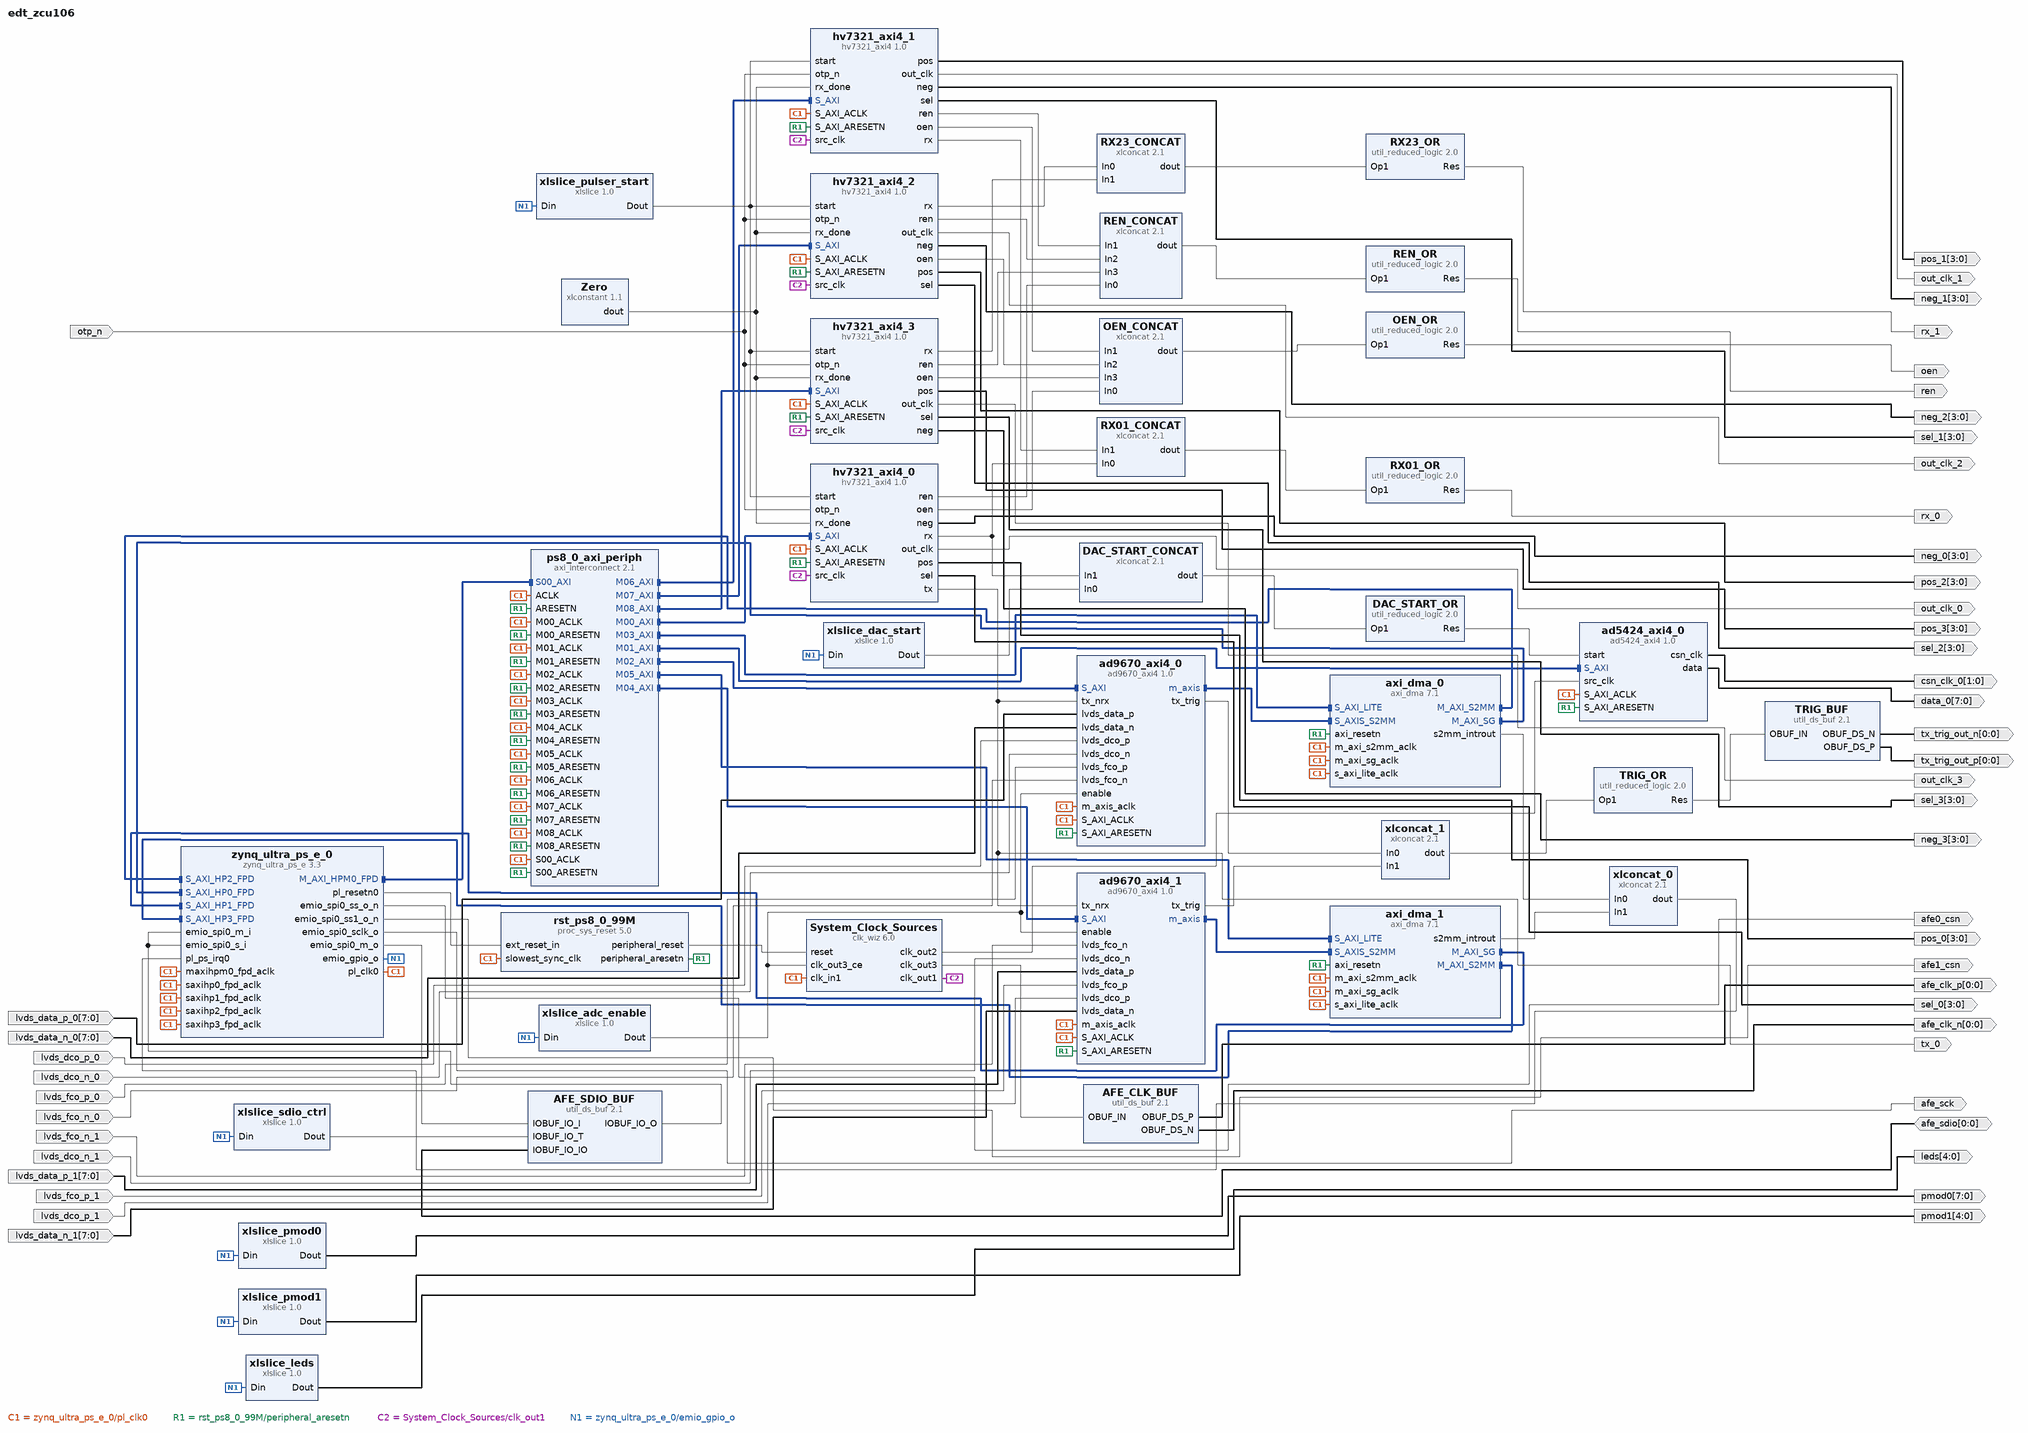
[diagram p0: block diagram of the top level]
# Vivado block design edt_zcu106, xczu7ev-ffvc1156-2-e, Vivado 2019.1
create_bd_design edt_zcu106

create_bd_port -dir O ren
create_bd_port -dir O oen
create_bd_port -dir O -from 3 -to 0 sel_0
create_bd_port -dir O -from 3 -to 0 pos_0
create_bd_port -dir O -from 3 -to 0 neg_0
create_bd_port -dir O -type clk out_clk_0
create_bd_port -dir I otp_n
create_bd_port -dir O -from 7 -to 0 data_0
create_bd_port -dir O -from 1 -to 0 -type clk csn_clk_0
create_bd_port -dir I -from 7 -to 0 lvds_data_p_0
create_bd_port -dir I -from 7 -to 0 lvds_data_n_0
create_bd_port -dir I -type clk lvds_dco_p_0
set_property -dict {CONFIG.FREQ_HZ 125000000} [get_bd_ports lvds_dco_p_0]
create_bd_port -dir I -type clk lvds_dco_n_0
set_property -dict {CONFIG.FREQ_HZ 125000000} [get_bd_ports lvds_dco_n_0]
create_bd_port -dir I -type clk lvds_fco_p_0
set_property -dict {CONFIG.FREQ_HZ 125000000} [get_bd_ports lvds_fco_p_0]
create_bd_port -dir I -type clk lvds_fco_n_0
set_property -dict {CONFIG.FREQ_HZ 125000000} [get_bd_ports lvds_fco_n_0]
create_bd_port -dir I -type clk lvds_fco_n_1
set_property -dict {CONFIG.FREQ_HZ 125000000} [get_bd_ports lvds_fco_n_1]
create_bd_port -dir I -type clk lvds_dco_n_1
set_property -dict {CONFIG.FREQ_HZ 125000000} [get_bd_ports lvds_dco_n_1]
create_bd_port -dir I -from 7 -to 0 lvds_data_p_1
create_bd_port -dir I -type clk lvds_fco_p_1
set_property -dict {CONFIG.FREQ_HZ 125000000} [get_bd_ports lvds_fco_p_1]
create_bd_port -dir I -type clk lvds_dco_p_1
set_property -dict {CONFIG.FREQ_HZ 125000000} [get_bd_ports lvds_dco_p_1]
create_bd_port -dir I -from 7 -to 0 lvds_data_n_1
create_bd_port -dir O -from 3 -to 0 pos_1
create_bd_port -dir O -type clk out_clk_1
create_bd_port -dir O -from 3 -to 0 sel_1
create_bd_port -dir O -from 3 -to 0 neg_1
create_bd_port -dir O -from 3 -to 0 pos_2
create_bd_port -dir O -type clk out_clk_2
create_bd_port -dir O -from 3 -to 0 sel_2
create_bd_port -dir O -from 3 -to 0 neg_2
create_bd_port -dir O -from 3 -to 0 pos_3
create_bd_port -dir O -type clk out_clk_3
create_bd_port -dir O -from 3 -to 0 sel_3
create_bd_port -dir O -from 3 -to 0 neg_3
create_bd_port -dir O rx_0
create_bd_port -dir O afe0_csn
create_bd_port -dir O afe1_csn
create_bd_port -dir O afe_sck
create_bd_port -dir IO -from 0 -to 0 afe_sdio
create_bd_port -dir O -from 0 -to 0 -type clk afe_clk_p
create_bd_port -dir O -from 0 -to 0 -type clk afe_clk_n
create_bd_port -dir O -from 7 -to 0 pmod0
create_bd_port -dir O -from 0 -to 0 -type clk tx_trig_out_p
set_property -dict {CONFIG.FREQ_HZ 39915362} [get_bd_ports tx_trig_out_p]
create_bd_port -dir O -from 0 -to 0 -type clk tx_trig_out_n
set_property -dict {CONFIG.FREQ_HZ 39915362} [get_bd_ports tx_trig_out_n]
create_bd_port -dir O rx_1
create_bd_port -dir O -type data tx_0
create_bd_port -dir O -from 4 -to 0 pmod1
create_bd_port -dir O -from 4 -to 0 leds

create_bd_cell -type ip -vlnv xilinx.com:ip:zynq_ultra_ps_e:3.3 zynq_ultra_ps_e_0
set_property -dict [list \
  CONFIG.CAN0_BOARD_INTERFACE custom \
  CONFIG.CAN1_BOARD_INTERFACE custom \
  CONFIG.CSU_BOARD_INTERFACE custom \
  CONFIG.DP_BOARD_INTERFACE custom \
  CONFIG.GEM0_BOARD_INTERFACE custom \
  CONFIG.GEM1_BOARD_INTERFACE custom \
  CONFIG.GEM2_BOARD_INTERFACE custom \
  CONFIG.GEM3_BOARD_INTERFACE custom \
  CONFIG.GPIO_BOARD_INTERFACE custom \
  CONFIG.IIC0_BOARD_INTERFACE custom \
  CONFIG.IIC1_BOARD_INTERFACE custom \
  CONFIG.NAND_BOARD_INTERFACE custom \
  CONFIG.PCIE_BOARD_INTERFACE custom \
  CONFIG.PJTAG_BOARD_INTERFACE custom \
  CONFIG.PMU_BOARD_INTERFACE custom \
  CONFIG.PSU_BANK_0_IO_STANDARD LVCMOS18 \
  CONFIG.PSU_BANK_1_IO_STANDARD LVCMOS18 \
  CONFIG.PSU_BANK_2_IO_STANDARD LVCMOS18 \
  CONFIG.PSU_BANK_3_IO_STANDARD LVCMOS33 \
  CONFIG.PSU_DYNAMIC_DDR_CONFIG_EN 1 \
  CONFIG.PSU_USB3__DUAL_CLOCK_ENABLE 1 \
  CONFIG.PSU__CAN1__PERIPHERAL__ENABLE 1 \
  CONFIG.PSU__CAN1__PERIPHERAL__IO {MIO 24 .. 25} \
  CONFIG.PSU__CRF_APB__ACPU_CTRL__FREQMHZ 1200 \
  CONFIG.PSU__CRF_APB__ACPU_CTRL__SRCSEL APLL \
  CONFIG.PSU__CRF_APB__APLL_CTRL__SRCSEL PSS_REF_CLK \
  CONFIG.PSU__CRF_APB__DBG_FPD_CTRL__FREQMHZ 250 \
  CONFIG.PSU__CRF_APB__DBG_FPD_CTRL__SRCSEL IOPLL \
  CONFIG.PSU__CRF_APB__DBG_TRACE_CTRL__FREQMHZ 250 \
  CONFIG.PSU__CRF_APB__DBG_TRACE_CTRL__SRCSEL IOPLL \
  CONFIG.PSU__CRF_APB__DBG_TSTMP_CTRL__FREQMHZ 250 \
  CONFIG.PSU__CRF_APB__DBG_TSTMP_CTRL__SRCSEL IOPLL \
  CONFIG.PSU__CRF_APB__DDR_CTRL__FREQMHZ 1067 \
  CONFIG.PSU__CRF_APB__DDR_CTRL__SRCSEL DPLL \
  CONFIG.PSU__CRF_APB__DPDMA_REF_CTRL__FREQMHZ 600 \
  CONFIG.PSU__CRF_APB__DPDMA_REF_CTRL__SRCSEL APLL \
  CONFIG.PSU__CRF_APB__DPLL_CTRL__SRCSEL PSS_REF_CLK \
  CONFIG.PSU__CRF_APB__DP_AUDIO_REF_CTRL__SRCSEL RPLL \
  CONFIG.PSU__CRF_APB__DP_STC_REF_CTRL__SRCSEL RPLL \
  CONFIG.PSU__CRF_APB__DP_VIDEO_REF_CTRL__SRCSEL VPLL \
  CONFIG.PSU__CRF_APB__GDMA_REF_CTRL__FREQMHZ 600 \
  CONFIG.PSU__CRF_APB__GDMA_REF_CTRL__SRCSEL APLL \
  CONFIG.PSU__CRF_APB__GPU_REF_CTRL__FREQMHZ 500 \
  CONFIG.PSU__CRF_APB__GPU_REF_CTRL__SRCSEL IOPLL \
  CONFIG.PSU__CRF_APB__TOPSW_LSBUS_CTRL__FREQMHZ 100 \
  CONFIG.PSU__CRF_APB__TOPSW_LSBUS_CTRL__SRCSEL IOPLL \
  CONFIG.PSU__CRF_APB__TOPSW_MAIN_CTRL__FREQMHZ 533.33 \
  CONFIG.PSU__CRF_APB__TOPSW_MAIN_CTRL__SRCSEL DPLL \
  CONFIG.PSU__CRF_APB__VPLL_CTRL__SRCSEL PSS_REF_CLK \
  CONFIG.PSU__CRL_APB__ADMA_REF_CTRL__FREQMHZ 500 \
  CONFIG.PSU__CRL_APB__ADMA_REF_CTRL__SRCSEL IOPLL \
  CONFIG.PSU__CRL_APB__CAN1_REF_CTRL__FREQMHZ 100 \
  CONFIG.PSU__CRL_APB__CAN1_REF_CTRL__SRCSEL IOPLL \
  CONFIG.PSU__CRL_APB__CPU_R5_CTRL__FREQMHZ 500 \
  CONFIG.PSU__CRL_APB__CPU_R5_CTRL__SRCSEL IOPLL \
  CONFIG.PSU__CRL_APB__DBG_LPD_CTRL__FREQMHZ 250 \
  CONFIG.PSU__CRL_APB__DBG_LPD_CTRL__SRCSEL IOPLL \
  CONFIG.PSU__CRL_APB__GEM3_REF_CTRL__FREQMHZ 125 \
  CONFIG.PSU__CRL_APB__GEM3_REF_CTRL__SRCSEL IOPLL \
  CONFIG.PSU__CRL_APB__I2C0_REF_CTRL__FREQMHZ 100 \
  CONFIG.PSU__CRL_APB__I2C0_REF_CTRL__SRCSEL IOPLL \
  CONFIG.PSU__CRL_APB__I2C1_REF_CTRL__FREQMHZ 100 \
  CONFIG.PSU__CRL_APB__I2C1_REF_CTRL__SRCSEL IOPLL \
  CONFIG.PSU__CRL_APB__IOPLL_CTRL__SRCSEL PSS_REF_CLK \
  CONFIG.PSU__CRL_APB__IOU_SWITCH_CTRL__FREQMHZ 250 \
  CONFIG.PSU__CRL_APB__IOU_SWITCH_CTRL__SRCSEL IOPLL \
  CONFIG.PSU__CRL_APB__LPD_LSBUS_CTRL__FREQMHZ 100 \
  CONFIG.PSU__CRL_APB__LPD_LSBUS_CTRL__SRCSEL IOPLL \
  CONFIG.PSU__CRL_APB__LPD_SWITCH_CTRL__FREQMHZ 500 \
  CONFIG.PSU__CRL_APB__LPD_SWITCH_CTRL__SRCSEL IOPLL \
  CONFIG.PSU__CRL_APB__PCAP_CTRL__FREQMHZ 200 \
  CONFIG.PSU__CRL_APB__PCAP_CTRL__SRCSEL IOPLL \
  CONFIG.PSU__CRL_APB__PL0_REF_CTRL__FREQMHZ 150 \
  CONFIG.PSU__CRL_APB__PL0_REF_CTRL__SRCSEL IOPLL \
  CONFIG.PSU__CRL_APB__QSPI_REF_CTRL__FREQMHZ 125 \
  CONFIG.PSU__CRL_APB__QSPI_REF_CTRL__SRCSEL IOPLL \
  CONFIG.PSU__CRL_APB__RPLL_CTRL__SRCSEL PSS_REF_CLK \
  CONFIG.PSU__CRL_APB__SDIO1_REF_CTRL__FREQMHZ 200 \
  CONFIG.PSU__CRL_APB__SDIO1_REF_CTRL__SRCSEL IOPLL \
  CONFIG.PSU__CRL_APB__TIMESTAMP_REF_CTRL__FREQMHZ 100 \
  CONFIG.PSU__CRL_APB__TIMESTAMP_REF_CTRL__SRCSEL IOPLL \
  CONFIG.PSU__CRL_APB__UART0_REF_CTRL__FREQMHZ 100 \
  CONFIG.PSU__CRL_APB__UART0_REF_CTRL__SRCSEL IOPLL \
  CONFIG.PSU__CRL_APB__UART1_REF_CTRL__FREQMHZ 100 \
  CONFIG.PSU__CRL_APB__UART1_REF_CTRL__SRCSEL IOPLL \
  CONFIG.PSU__CRL_APB__USB0_BUS_REF_CTRL__FREQMHZ 250 \
  CONFIG.PSU__CRL_APB__USB0_BUS_REF_CTRL__SRCSEL IOPLL \
  CONFIG.PSU__CRL_APB__USB3_DUAL_REF_CTRL__FREQMHZ 20 \
  CONFIG.PSU__CRL_APB__USB3_DUAL_REF_CTRL__SRCSEL IOPLL \
  CONFIG.PSU__CRL_APB__USB3__ENABLE 1 \
  CONFIG.PSU__CSUPMU__PERIPHERAL__VALID 1 \
  CONFIG.PSU__DDRC__BUS_WIDTH {64 Bit} \
  CONFIG.PSU__DDRC__COMPONENTS UDIMM \
  CONFIG.PSU__DDRC__DEVICE_CAPACITY {8192 MBits} \
  CONFIG.PSU__DDRC__DRAM_WIDTH {16 Bits} \
  CONFIG.PSU__DDRC__ECC Disabled \
  CONFIG.PSU__DDRC__MEMORY_TYPE {DDR 4} \
  CONFIG.PSU__DDRC__SPEED_BIN DDR4_2133P \
  CONFIG.PSU__DDR_HIGH_ADDRESS_GUI_ENABLE 1 \
  CONFIG.PSU__DDR__INTERFACE__FREQMHZ 533.500 \
  CONFIG.PSU__DEVICE_TYPE EV \
  CONFIG.PSU__DISPLAYPORT__LANE0__ENABLE 1 \
  CONFIG.PSU__DISPLAYPORT__LANE0__IO {GT Lane1} \
  CONFIG.PSU__DISPLAYPORT__LANE1__ENABLE 1 \
  CONFIG.PSU__DISPLAYPORT__LANE1__IO {GT Lane0} \
  CONFIG.PSU__DISPLAYPORT__PERIPHERAL__ENABLE 1 \
  CONFIG.PSU__DLL__ISUSED 1 \
  CONFIG.PSU__DPAUX__PERIPHERAL__ENABLE 1 \
  CONFIG.PSU__DPAUX__PERIPHERAL__IO {MIO 27 .. 30} \
  CONFIG.PSU__DP__LANE_SEL {Dual Lower} \
  CONFIG.PSU__DP__REF_CLK_FREQ 27 \
  CONFIG.PSU__DP__REF_CLK_SEL {Ref Clk3} \
  CONFIG.PSU__ENET3__FIFO__ENABLE 0 \
  CONFIG.PSU__ENET3__GRP_MDIO__ENABLE 1 \
  CONFIG.PSU__ENET3__GRP_MDIO__IO {MIO 76 .. 77} \
  CONFIG.PSU__ENET3__PERIPHERAL__ENABLE 1 \
  CONFIG.PSU__ENET3__PERIPHERAL__IO {MIO 64 .. 75} \
  CONFIG.PSU__ENET3__PTP__ENABLE 0 \
  CONFIG.PSU__ENET3__TSU__ENABLE 0 \
  CONFIG.PSU__FPGA_PL0_ENABLE 1 \
  CONFIG.PSU__GEM3_COHERENCY 0 \
  CONFIG.PSU__GEM3_ROUTE_THROUGH_FPD 0 \
  CONFIG.PSU__GEM__TSU__ENABLE 0 \
  CONFIG.PSU__GPIO0_MIO__IO {MIO 0 .. 25} \
  CONFIG.PSU__GPIO0_MIO__PERIPHERAL__ENABLE 1 \
  CONFIG.PSU__GPIO1_MIO__IO {MIO 26 .. 51} \
  CONFIG.PSU__GPIO1_MIO__PERIPHERAL__ENABLE 1 \
  CONFIG.PSU__GPIO_EMIO_WIDTH 25 \
  CONFIG.PSU__GPIO_EMIO__PERIPHERAL__ENABLE 1 \
  CONFIG.PSU__GPIO_EMIO__PERIPHERAL__IO 25 \
  CONFIG.PSU__GT__LINK_SPEED HBR \
  CONFIG.PSU__GT__PRE_EMPH_LVL_4 0 \
  CONFIG.PSU__GT__VLT_SWNG_LVL_4 0 \
  CONFIG.PSU__I2C0__PERIPHERAL__ENABLE 1 \
  CONFIG.PSU__I2C0__PERIPHERAL__IO {MIO 14 .. 15} \
  CONFIG.PSU__I2C1__PERIPHERAL__ENABLE 1 \
  CONFIG.PSU__I2C1__PERIPHERAL__IO {MIO 16 .. 17} \
  CONFIG.PSU__IOU_SLCR__IOU_TTC_APB_CLK__TTC0_SEL APB \
  CONFIG.PSU__IOU_SLCR__IOU_TTC_APB_CLK__TTC1_SEL APB \
  CONFIG.PSU__IOU_SLCR__IOU_TTC_APB_CLK__TTC2_SEL APB \
  CONFIG.PSU__IOU_SLCR__IOU_TTC_APB_CLK__TTC3_SEL APB \
  CONFIG.PSU__MAXIGP0__DATA_WIDTH 32 \
  CONFIG.PSU__OVERRIDE_HPX_QOS 0 \
  CONFIG.PSU__OVERRIDE__BASIC_CLOCK 0 \
  CONFIG.PSU__PMU_COHERENCY 0 \
  CONFIG.PSU__PMU__AIBACK__ENABLE 0 \
  CONFIG.PSU__PMU__EMIO_GPI__ENABLE 0 \
  CONFIG.PSU__PMU__EMIO_GPO__ENABLE 0 \
  CONFIG.PSU__PMU__GPI0__ENABLE 0 \
  CONFIG.PSU__PMU__GPI1__ENABLE 0 \
  CONFIG.PSU__PMU__GPI2__ENABLE 0 \
  CONFIG.PSU__PMU__GPI3__ENABLE 0 \
  CONFIG.PSU__PMU__GPI4__ENABLE 0 \
  CONFIG.PSU__PMU__GPI5__ENABLE 0 \
  CONFIG.PSU__PMU__GPO0__ENABLE 1 \
  CONFIG.PSU__PMU__GPO0__IO {MIO 32} \
  CONFIG.PSU__PMU__GPO1__ENABLE 1 \
  CONFIG.PSU__PMU__GPO1__IO {MIO 33} \
  CONFIG.PSU__PMU__GPO2__ENABLE 1 \
  CONFIG.PSU__PMU__GPO2__IO {MIO 34} \
  CONFIG.PSU__PMU__GPO2__POLARITY low \
  CONFIG.PSU__PMU__GPO3__ENABLE 1 \
  CONFIG.PSU__PMU__GPO3__IO {MIO 35} \
  CONFIG.PSU__PMU__GPO3__POLARITY low \
  CONFIG.PSU__PMU__GPO4__ENABLE 1 \
  CONFIG.PSU__PMU__GPO4__IO {MIO 36} \
  CONFIG.PSU__PMU__GPO4__POLARITY low \
  CONFIG.PSU__PMU__GPO5__ENABLE 1 \
  CONFIG.PSU__PMU__GPO5__IO {MIO 37} \
  CONFIG.PSU__PMU__GPO5__POLARITY low \
  CONFIG.PSU__PMU__PERIPHERAL__ENABLE 1 \
  CONFIG.PSU__PMU__PLERROR__ENABLE 0 \
  CONFIG.PSU__PRESET_APPLIED 1 \
  CONFIG.PSU__PSS_REF_CLK__FREQMHZ 33.330 \
  CONFIG.PSU__QSPI_COHERENCY 0 \
  CONFIG.PSU__QSPI_ROUTE_THROUGH_FPD 0 \
  CONFIG.PSU__QSPI__GRP_FBCLK__ENABLE 1 \
  CONFIG.PSU__QSPI__GRP_FBCLK__IO {MIO 6} \
  CONFIG.PSU__QSPI__PERIPHERAL__DATA_MODE x4 \
  CONFIG.PSU__QSPI__PERIPHERAL__ENABLE 1 \
  CONFIG.PSU__QSPI__PERIPHERAL__IO {MIO 0 .. 12} \
  CONFIG.PSU__QSPI__PERIPHERAL__MODE {Dual Parallel} \
  CONFIG.PSU__SATA__LANE1__IO {GT Lane3} \
  CONFIG.PSU__SATA__PERIPHERAL__ENABLE 1 \
  CONFIG.PSU__SATA__REF_CLK_FREQ 125 \
  CONFIG.PSU__SATA__REF_CLK_SEL {Ref Clk1} \
  CONFIG.PSU__SAXIGP2__DATA_WIDTH 32 \
  CONFIG.PSU__SAXIGP3__DATA_WIDTH 32 \
  CONFIG.PSU__SD1_COHERENCY 0 \
  CONFIG.PSU__SD1_ROUTE_THROUGH_FPD 0 \
  CONFIG.PSU__SD1__DATA_TRANSFER_MODE 8Bit \
  CONFIG.PSU__SD1__GRP_CD__ENABLE 1 \
  CONFIG.PSU__SD1__GRP_CD__IO {MIO 45} \
  CONFIG.PSU__SD1__GRP_POW__ENABLE 1 \
  CONFIG.PSU__SD1__GRP_POW__IO {MIO 43} \
  CONFIG.PSU__SD1__GRP_WP__ENABLE 1 \
  CONFIG.PSU__SD1__GRP_WP__IO {MIO 44} \
  CONFIG.PSU__SD1__PERIPHERAL__ENABLE 1 \
  CONFIG.PSU__SD1__PERIPHERAL__IO {MIO 39 .. 51} \
  CONFIG.PSU__SD1__SLOT_TYPE {SD 3.0} \
  CONFIG.PSU__SPI0__GRP_SS0__IO EMIO \
  CONFIG.PSU__SPI0__GRP_SS1__ENABLE 1 \
  CONFIG.PSU__SPI0__GRP_SS1__IO EMIO \
  CONFIG.PSU__SPI0__PERIPHERAL__ENABLE 1 \
  CONFIG.PSU__SPI0__PERIPHERAL__IO EMIO \
  CONFIG.PSU__SWDT0__CLOCK__ENABLE 0 \
  CONFIG.PSU__SWDT0__PERIPHERAL__ENABLE 1 \
  CONFIG.PSU__SWDT0__RESET__ENABLE 0 \
  CONFIG.PSU__SWDT1__CLOCK__ENABLE 0 \
  CONFIG.PSU__SWDT1__PERIPHERAL__ENABLE 1 \
  CONFIG.PSU__SWDT1__RESET__ENABLE 0 \
  CONFIG.PSU__TSU__BUFG_PORT_PAIR 0 \
  CONFIG.PSU__TTC0__CLOCK__ENABLE 0 \
  CONFIG.PSU__TTC0__PERIPHERAL__ENABLE 1 \
  CONFIG.PSU__TTC0__WAVEOUT__ENABLE 0 \
  CONFIG.PSU__TTC1__CLOCK__ENABLE 0 \
  CONFIG.PSU__TTC1__PERIPHERAL__ENABLE 1 \
  CONFIG.PSU__TTC1__WAVEOUT__ENABLE 0 \
  CONFIG.PSU__TTC2__CLOCK__ENABLE 0 \
  CONFIG.PSU__TTC2__PERIPHERAL__ENABLE 1 \
  CONFIG.PSU__TTC2__WAVEOUT__ENABLE 0 \
  CONFIG.PSU__TTC3__CLOCK__ENABLE 0 \
  CONFIG.PSU__TTC3__PERIPHERAL__ENABLE 1 \
  CONFIG.PSU__TTC3__WAVEOUT__ENABLE 0 \
  CONFIG.PSU__UART0__BAUD_RATE 115200 \
  CONFIG.PSU__UART0__MODEM__ENABLE 0 \
  CONFIG.PSU__UART0__PERIPHERAL__ENABLE 1 \
  CONFIG.PSU__UART0__PERIPHERAL__IO {MIO 18 .. 19} \
  CONFIG.PSU__UART1__BAUD_RATE 115200 \
  CONFIG.PSU__UART1__MODEM__ENABLE 0 \
  CONFIG.PSU__UART1__PERIPHERAL__ENABLE 1 \
  CONFIG.PSU__UART1__PERIPHERAL__IO {MIO 20 .. 21} \
  CONFIG.PSU__USB0_COHERENCY 0 \
  CONFIG.PSU__USB0__PERIPHERAL__ENABLE 1 \
  CONFIG.PSU__USB0__PERIPHERAL__IO {MIO 52 .. 63} \
  CONFIG.PSU__USB0__REF_CLK_FREQ 26 \
  CONFIG.PSU__USB0__REF_CLK_SEL {Ref Clk2} \
  CONFIG.PSU__USB2_0__EMIO__ENABLE 0 \
  CONFIG.PSU__USB3_0__EMIO__ENABLE 0 \
  CONFIG.PSU__USB3_0__PERIPHERAL__ENABLE 1 \
  CONFIG.PSU__USB3_0__PERIPHERAL__IO {GT Lane2} \
  CONFIG.PSU__USB__RESET__MODE {Boot Pin} \
  CONFIG.PSU__USB__RESET__POLARITY {Active Low} \
  CONFIG.PSU__USE__IRQ0 1 \
  CONFIG.PSU__USE__M_AXI_GP0 1 \
  CONFIG.PSU__USE__M_AXI_GP1 0 \
  CONFIG.PSU__USE__M_AXI_GP2 0 \
  CONFIG.PSU__USE__S_AXI_GP2 1 \
  CONFIG.PSU__USE__S_AXI_GP3 1 \
  CONFIG.PSU__USE__S_AXI_GP4 1 \
  CONFIG.PSU__USE__S_AXI_GP5 1 \
  CONFIG.QSPI_BOARD_INTERFACE custom \
  CONFIG.SATA_BOARD_INTERFACE custom \
  CONFIG.SD0_BOARD_INTERFACE custom \
  CONFIG.SD1_BOARD_INTERFACE custom \
  CONFIG.SPI0_BOARD_INTERFACE custom \
  CONFIG.SPI1_BOARD_INTERFACE custom \
  CONFIG.SUBPRESET1 Custom \
  CONFIG.SUBPRESET2 Custom \
  CONFIG.SWDT0_BOARD_INTERFACE custom \
  CONFIG.SWDT1_BOARD_INTERFACE custom \
  CONFIG.TRACE_BOARD_INTERFACE custom \
  CONFIG.TTC0_BOARD_INTERFACE custom \
  CONFIG.TTC1_BOARD_INTERFACE custom \
  CONFIG.TTC2_BOARD_INTERFACE custom \
  CONFIG.TTC3_BOARD_INTERFACE custom \
  CONFIG.UART0_BOARD_INTERFACE custom \
  CONFIG.UART1_BOARD_INTERFACE custom \
  CONFIG.USB0_BOARD_INTERFACE custom \
  CONFIG.USB1_BOARD_INTERFACE custom \
] [get_bd_cells zynq_ultra_ps_e_0]
# 724 more settings of zynq_ultra_ps_e_0 are not shown: defaults, MIO pin electricals, DDR timing, and values the tool derives
create_bd_cell -type ip -vlnv xilinx.com:ip:axi_interconnect:2.1 ps8_0_axi_periph
set_property -dict {CONFIG.NUM_MI 9} [get_bd_cells ps8_0_axi_periph]
create_bd_cell -type ip -vlnv xilinx.com:ip:proc_sys_reset:5.0 rst_ps8_0_99M
create_bd_cell -type ip -vlnv xilinx.com:ip:clk_wiz:6.0 System_Clock_Sources
set_property -dict [list \
  CONFIG.CLKOUT1_DRIVES No_buffer \
  CONFIG.CLKOUT1_JITTER 138.287 \
  CONFIG.CLKOUT1_PHASE_ERROR 162.628 \
  CONFIG.CLKOUT1_REQUESTED_OUT_FREQ 220 \
  CONFIG.CLKOUT2_DRIVES No_buffer \
  CONFIG.CLKOUT2_JITTER 224.450 \
  CONFIG.CLKOUT2_PHASE_ERROR 162.628 \
  CONFIG.CLKOUT2_REQUESTED_OUT_FREQ 20 \
  CONFIG.CLKOUT2_USED true \
  CONFIG.CLKOUT3_DRIVES BUFGCE \
  CONFIG.CLKOUT3_JITTER 167.393 \
  CONFIG.CLKOUT3_PHASE_ERROR 162.628 \
  CONFIG.CLKOUT3_REQUESTED_OUT_FREQ 80 \
  CONFIG.CLKOUT3_USED true \
  CONFIG.FEEDBACK_SOURCE FDBK_ONCHIP \
  CONFIG.MMCM_CLKFBOUT_MULT_F 19.250 \
  CONFIG.MMCM_CLKOUT0_DIVIDE_F 4.375 \
  CONFIG.MMCM_CLKOUT1_DIVIDE 48 \
  CONFIG.MMCM_CLKOUT2_DIVIDE 12 \
  CONFIG.MMCM_DIVCLK_DIVIDE 3 \
  CONFIG.NUM_OUT_CLKS 3 \
] [get_bd_cells System_Clock_Sources]
create_bd_cell -type ip -vlnv xilinx.com:ip:xlconstant:1.1 Zero
set_property -dict {CONFIG.CONST_VAL 0} [get_bd_cells Zero]
create_bd_cell -type ip -vlnv xilinx.com:ip:axi_dma:7.1 axi_dma_0
set_property -dict [list \
  CONFIG.c_include_mm2s 0 \
  CONFIG.c_include_sg 1 \
  CONFIG.c_micro_dma 0 \
  CONFIG.c_sg_include_stscntrl_strm 0 \
] [get_bd_cells axi_dma_0]
create_bd_cell -type ip -vlnv xilinx.com:ip:axi_dma:7.1 axi_dma_1
set_property -dict [list \
  CONFIG.c_include_mm2s 0 \
  CONFIG.c_include_sg 1 \
  CONFIG.c_micro_dma 0 \
  CONFIG.c_s2mm_burst_size 256 \
  CONFIG.c_sg_include_stscntrl_strm 0 \
] [get_bd_cells axi_dma_1]
create_bd_cell -type ip -vlnv xilinx.com:ip:xlconcat:2.1 xlconcat_0
create_bd_cell -type ip -vlnv xilinx.com:ip:util_reduced_logic:2.0 REN_OR
set_property -dict {CONFIG.C_OPERATION or CONFIG.C_SIZE 4} [get_bd_cells REN_OR]
create_bd_cell -type ip -vlnv xilinx.com:ip:util_reduced_logic:2.0 OEN_OR
set_property -dict {CONFIG.C_OPERATION or CONFIG.C_SIZE 4} [get_bd_cells OEN_OR]
create_bd_cell -type ip -vlnv xilinx.com:ip:xlconcat:2.1 REN_CONCAT
set_property -dict {CONFIG.NUM_PORTS 4} [get_bd_cells REN_CONCAT]
create_bd_cell -type ip -vlnv xilinx.com:ip:xlconcat:2.1 OEN_CONCAT
set_property -dict {CONFIG.NUM_PORTS 4} [get_bd_cells OEN_CONCAT]
create_bd_cell -type ip -vlnv xilinx.com:ip:util_ds_buf:2.1 AFE_SDIO_BUF
set_property -dict {CONFIG.C_BUF_TYPE IOBUF} [get_bd_cells AFE_SDIO_BUF]
create_bd_cell -type ip -vlnv xilinx.com:ip:util_ds_buf:2.1 AFE_CLK_BUF
set_property -dict {CONFIG.C_BUF_TYPE OBUFDS} [get_bd_cells AFE_CLK_BUF]
create_bd_cell -type ip -vlnv xilinx.com:ip:xlslice:1.0 xlslice_sdio_ctrl
set_property -dict {CONFIG.DIN_FROM 2 CONFIG.DIN_TO 2 CONFIG.DIN_WIDTH 25 CONFIG.DOUT_WIDTH 1} [get_bd_cells xlslice_sdio_ctrl]
create_bd_cell -type ip -vlnv xilinx.com:ip:xlslice:1.0 xlslice_pmod0
set_property -dict {CONFIG.DIN_FROM 15 CONFIG.DIN_TO 8 CONFIG.DIN_WIDTH 25 CONFIG.DOUT_WIDTH 8} [get_bd_cells xlslice_pmod0]
create_bd_cell -type ip -vlnv xilinx.com:ip:util_ds_buf:2.1 TRIG_BUF
set_property -dict {CONFIG.C_BUF_TYPE OBUFDS} [get_bd_cells TRIG_BUF]
create_bd_cell -type ip -vlnv xilinx.com:ip:util_reduced_logic:2.0 TRIG_OR
set_property -dict {CONFIG.C_OPERATION or CONFIG.C_SIZE 2} [get_bd_cells TRIG_OR]
create_bd_cell -type ip -vlnv xilinx.com:ip:xlconcat:2.1 xlconcat_1
create_bd_cell -type ip -vlnv creare.com:user:ad9670_axi4:1.0 ad9670_axi4_0
create_bd_cell -type ip -vlnv creare.com:user:ad9670_axi4:1.0 ad9670_axi4_1
create_bd_cell -type ip -vlnv creare.com:user:hv7321_axi4:1.0 hv7321_axi4_0
create_bd_cell -type ip -vlnv creare.com:user:hv7321_axi4:1.0 hv7321_axi4_1
create_bd_cell -type ip -vlnv creare.com:user:hv7321_axi4:1.0 hv7321_axi4_2
create_bd_cell -type ip -vlnv creare.com:user:hv7321_axi4:1.0 hv7321_axi4_3
create_bd_cell -type ip -vlnv xilinx.com:ip:util_reduced_logic:2.0 RX01_OR
set_property -dict {CONFIG.C_OPERATION or CONFIG.C_SIZE 2} [get_bd_cells RX01_OR]
create_bd_cell -type ip -vlnv xilinx.com:ip:xlconcat:2.1 RX01_CONCAT
set_property -dict {CONFIG.NUM_PORTS 2} [get_bd_cells RX01_CONCAT]
create_bd_cell -type ip -vlnv xilinx.com:ip:xlconcat:2.1 RX23_CONCAT
set_property -dict {CONFIG.NUM_PORTS 2} [get_bd_cells RX23_CONCAT]
create_bd_cell -type ip -vlnv xilinx.com:ip:util_reduced_logic:2.0 RX23_OR
set_property -dict {CONFIG.C_OPERATION or CONFIG.C_SIZE 2} [get_bd_cells RX23_OR]
create_bd_cell -type ip -vlnv xilinx.com:ip:xlslice:1.0 xlslice_pmod1
set_property -dict {CONFIG.DIN_FROM 7 CONFIG.DIN_TO 3 CONFIG.DIN_WIDTH 25 CONFIG.DOUT_WIDTH 5} [get_bd_cells xlslice_pmod1]
create_bd_cell -type ip -vlnv xilinx.com:ip:xlslice:1.0 xlslice_leds
set_property -dict {CONFIG.DIN_FROM 7 CONFIG.DIN_TO 3 CONFIG.DIN_WIDTH 25 CONFIG.DOUT_WIDTH 5} [get_bd_cells xlslice_leds]
create_bd_cell -type ip -vlnv xilinx.com:ip:xlslice:1.0 xlslice_pulser_start
set_property -dict {CONFIG.DIN_FROM 0 CONFIG.DIN_TO 0 CONFIG.DIN_WIDTH 25} [get_bd_cells xlslice_pulser_start]
create_bd_cell -type ip -vlnv xilinx.com:ip:xlslice:1.0 xlslice_dac_start
set_property -dict {CONFIG.DIN_FROM 0 CONFIG.DIN_TO 0 CONFIG.DIN_WIDTH 25 CONFIG.DOUT_WIDTH 1} [get_bd_cells xlslice_dac_start]
create_bd_cell -type ip -vlnv xilinx.com:ip:xlslice:1.0 xlslice_adc_enable
set_property -dict {CONFIG.DIN_FROM 1 CONFIG.DIN_TO 1 CONFIG.DIN_WIDTH 25 CONFIG.DOUT_WIDTH 1} [get_bd_cells xlslice_adc_enable]
create_bd_cell -type ip -vlnv xilinx.com:ip:xlconcat:2.1 DAC_START_CONCAT
set_property -dict {CONFIG.NUM_PORTS 2} [get_bd_cells DAC_START_CONCAT]
create_bd_cell -type ip -vlnv xilinx.com:ip:util_reduced_logic:2.0 DAC_START_OR
set_property -dict {CONFIG.C_OPERATION or CONFIG.C_SIZE 2} [get_bd_cells DAC_START_OR]
create_bd_cell -type ip -vlnv creare.com:user:ad5424_axi4:1.0 ad5424_axi4_0
set_property -dict {CONFIG.C_N_DAC 2} [get_bd_cells ad5424_axi4_0]

# ---- connections ----

connect_bd_intf_net [get_bd_intf_pins ad9670_axi4_0/m_axis] [get_bd_intf_pins axi_dma_0/S_AXIS_S2MM]
connect_bd_intf_net [get_bd_intf_pins axi_dma_0/M_AXI_S2MM] [get_bd_intf_pins zynq_ultra_ps_e_0/S_AXI_HP2_FPD]
connect_bd_intf_net [get_bd_intf_pins ps8_0_axi_periph/M08_AXI] [get_bd_intf_pins hv7321_axi4_3/S_AXI]
connect_bd_intf_net [get_bd_intf_pins ps8_0_axi_periph/M03_AXI] [get_bd_intf_pins axi_dma_0/S_AXI_LITE]
connect_bd_intf_net [get_bd_intf_pins ps8_0_axi_periph/M01_AXI] [get_bd_intf_pins ad5424_axi4_0/S_AXI]
connect_bd_intf_net [get_bd_intf_pins ps8_0_axi_periph/M00_AXI] [get_bd_intf_pins hv7321_axi4_0/S_AXI]
connect_bd_intf_net [get_bd_intf_pins ps8_0_axi_periph/M05_AXI] [get_bd_intf_pins axi_dma_1/S_AXI_LITE]
connect_bd_intf_net [get_bd_intf_pins ps8_0_axi_periph/M07_AXI] [get_bd_intf_pins hv7321_axi4_2/S_AXI]
connect_bd_intf_net [get_bd_intf_pins zynq_ultra_ps_e_0/M_AXI_HPM0_FPD] [get_bd_intf_pins ps8_0_axi_periph/S00_AXI]
connect_bd_intf_net [get_bd_intf_pins ps8_0_axi_periph/M06_AXI] [get_bd_intf_pins hv7321_axi4_1/S_AXI]
connect_bd_intf_net [get_bd_intf_pins ps8_0_axi_periph/M02_AXI] [get_bd_intf_pins ad9670_axi4_0/S_AXI]
connect_bd_intf_net [get_bd_intf_pins ad9670_axi4_1/m_axis] [get_bd_intf_pins axi_dma_1/S_AXIS_S2MM]
connect_bd_intf_net [get_bd_intf_pins ps8_0_axi_periph/M04_AXI] [get_bd_intf_pins ad9670_axi4_1/S_AXI]
connect_bd_intf_net [get_bd_intf_pins axi_dma_1/M_AXI_SG] [get_bd_intf_pins zynq_ultra_ps_e_0/S_AXI_HP1_FPD]
connect_bd_intf_net [get_bd_intf_pins axi_dma_0/M_AXI_SG] [get_bd_intf_pins zynq_ultra_ps_e_0/S_AXI_HP0_FPD]
connect_bd_intf_net [get_bd_intf_pins axi_dma_1/M_AXI_S2MM] [get_bd_intf_pins zynq_ultra_ps_e_0/S_AXI_HP3_FPD]
connect_bd_net [get_bd_pins zynq_ultra_ps_e_0/pl_clk0] \
  [get_bd_pins ps8_0_axi_periph/ACLK] [get_bd_pins zynq_ultra_ps_e_0/maxihpm0_fpd_aclk] \
  [get_bd_pins ps8_0_axi_periph/S00_ACLK] [get_bd_pins rst_ps8_0_99M/slowest_sync_clk] \
  [get_bd_pins ps8_0_axi_periph/M00_ACLK] [get_bd_pins System_Clock_Sources/clk_in1] [get_bd_pins ps8_0_axi_periph/M01_ACLK] \
  [get_bd_pins ps8_0_axi_periph/M02_ACLK] [get_bd_pins zynq_ultra_ps_e_0/saxihp2_fpd_aclk] \
  [get_bd_pins axi_dma_0/m_axi_s2mm_aclk] [get_bd_pins axi_dma_0/s_axi_lite_aclk] [get_bd_pins ps8_0_axi_periph/M03_ACLK] \
  [get_bd_pins zynq_ultra_ps_e_0/saxihp3_fpd_aclk] [get_bd_pins axi_dma_1/m_axi_s2mm_aclk] \
  [get_bd_pins ps8_0_axi_periph/M04_ACLK] [get_bd_pins axi_dma_1/s_axi_lite_aclk] [get_bd_pins ps8_0_axi_periph/M05_ACLK] \
  [get_bd_pins ps8_0_axi_periph/M06_ACLK] [get_bd_pins ps8_0_axi_periph/M07_ACLK] [get_bd_pins ps8_0_axi_periph/M08_ACLK] \
  [get_bd_pins axi_dma_0/m_axi_sg_aclk] [get_bd_pins axi_dma_1/m_axi_sg_aclk] \
  [get_bd_pins zynq_ultra_ps_e_0/saxihp0_fpd_aclk] [get_bd_pins zynq_ultra_ps_e_0/saxihp1_fpd_aclk] \
  [get_bd_pins ad9670_axi4_0/S_AXI_ACLK] [get_bd_pins ad9670_axi4_0/m_axis_aclk] [get_bd_pins ad9670_axi4_1/S_AXI_ACLK] \
  [get_bd_pins ad9670_axi4_1/m_axis_aclk] [get_bd_pins hv7321_axi4_0/S_AXI_ACLK] [get_bd_pins hv7321_axi4_1/S_AXI_ACLK] \
  [get_bd_pins hv7321_axi4_2/S_AXI_ACLK] [get_bd_pins hv7321_axi4_3/S_AXI_ACLK] [get_bd_pins ad5424_axi4_0/S_AXI_ACLK]
connect_bd_net [get_bd_pins zynq_ultra_ps_e_0/pl_resetn0] [get_bd_pins rst_ps8_0_99M/ext_reset_in]
connect_bd_net [get_bd_pins rst_ps8_0_99M/peripheral_aresetn] \
  [get_bd_pins ps8_0_axi_periph/S00_ARESETN] [get_bd_pins ps8_0_axi_periph/M00_ARESETN] \
  [get_bd_pins ps8_0_axi_periph/ARESETN] [get_bd_pins ps8_0_axi_periph/M01_ARESETN] \
  [get_bd_pins ps8_0_axi_periph/M02_ARESETN] [get_bd_pins axi_dma_0/axi_resetn] [get_bd_pins ps8_0_axi_periph/M03_ARESETN] \
  [get_bd_pins ps8_0_axi_periph/M04_ARESETN] [get_bd_pins axi_dma_1/axi_resetn] [get_bd_pins ps8_0_axi_periph/M05_ARESETN] \
  [get_bd_pins ps8_0_axi_periph/M06_ARESETN] [get_bd_pins ps8_0_axi_periph/M07_ARESETN] \
  [get_bd_pins ps8_0_axi_periph/M08_ARESETN] [get_bd_pins ad9670_axi4_0/S_AXI_ARESETN] \
  [get_bd_pins ad9670_axi4_1/S_AXI_ARESETN] [get_bd_pins hv7321_axi4_0/S_AXI_ARESETN] \
  [get_bd_pins hv7321_axi4_1/S_AXI_ARESETN] [get_bd_pins hv7321_axi4_2/S_AXI_ARESETN] \
  [get_bd_pins hv7321_axi4_3/S_AXI_ARESETN] [get_bd_pins ad5424_axi4_0/S_AXI_ARESETN]
connect_bd_net -net clk_wiz_clk_out1 [get_bd_pins System_Clock_Sources/clk_out1] \
  [get_bd_pins hv7321_axi4_0/src_clk] [get_bd_pins hv7321_axi4_1/src_clk] [get_bd_pins hv7321_axi4_2/src_clk] \
  [get_bd_pins hv7321_axi4_3/src_clk]
connect_bd_net [get_bd_pins rst_ps8_0_99M/peripheral_reset] [get_bd_pins System_Clock_Sources/reset]
connect_bd_net [get_bd_pins hv7321_axi4_0/sel] [get_bd_ports sel_0]
connect_bd_net [get_bd_pins hv7321_axi4_0/pos] [get_bd_ports pos_0]
connect_bd_net [get_bd_pins hv7321_axi4_0/neg] [get_bd_ports neg_0]
connect_bd_net [get_bd_pins hv7321_axi4_0/out_clk] [get_bd_ports out_clk_0]
connect_bd_net -net otp_n_0_1 [get_bd_ports otp_n] \
  [get_bd_pins hv7321_axi4_0/otp_n] [get_bd_pins hv7321_axi4_1/otp_n] [get_bd_pins hv7321_axi4_2/otp_n] \
  [get_bd_pins hv7321_axi4_3/otp_n]
connect_bd_net -net start_0_1 [get_bd_pins xlslice_pulser_start/Dout] \
  [get_bd_pins hv7321_axi4_0/start] [get_bd_pins hv7321_axi4_1/start] [get_bd_pins hv7321_axi4_2/start] \
  [get_bd_pins hv7321_axi4_3/start]
connect_bd_net [get_bd_pins Zero/dout] \
  [get_bd_pins hv7321_axi4_0/rx_done] [get_bd_pins hv7321_axi4_1/rx_done] [get_bd_pins hv7321_axi4_2/rx_done] \
  [get_bd_pins hv7321_axi4_3/rx_done]
connect_bd_net [get_bd_pins ad5424_axi4_0/data] [get_bd_ports data_0]
connect_bd_net [get_bd_pins System_Clock_Sources/clk_out2] [get_bd_pins ad5424_axi4_0/src_clk]
connect_bd_net [get_bd_pins ad5424_axi4_0/csn_clk] [get_bd_ports csn_clk_0]
connect_bd_net -net lvds_data_p_0_1 [get_bd_ports lvds_data_p_0] [get_bd_pins ad9670_axi4_0/lvds_data_p]
connect_bd_net -net lvds_data_n_0_1 [get_bd_ports lvds_data_n_0] [get_bd_pins ad9670_axi4_0/lvds_data_n]
connect_bd_net -net lvds_dco_p_0_1 [get_bd_ports lvds_dco_p_0] [get_bd_pins ad9670_axi4_0/lvds_dco_p]
connect_bd_net -net lvds_dco_n_0_1 [get_bd_ports lvds_dco_n_0] [get_bd_pins ad9670_axi4_0/lvds_dco_n]
connect_bd_net -net lvds_fco_p_0_1 [get_bd_ports lvds_fco_p_0] [get_bd_pins ad9670_axi4_0/lvds_fco_p]
connect_bd_net -net lvds_fco_n_0_1 [get_bd_ports lvds_fco_n_0] [get_bd_pins ad9670_axi4_0/lvds_fco_n]
connect_bd_net [get_bd_pins axi_dma_0/s2mm_introut] [get_bd_pins xlconcat_0/In0]
connect_bd_net [get_bd_pins axi_dma_1/s2mm_introut] [get_bd_pins xlconcat_0/In1]
connect_bd_net [get_bd_pins xlconcat_0/dout] [get_bd_pins zynq_ultra_ps_e_0/pl_ps_irq0]
connect_bd_net -net lvds_fco_n_1_1 [get_bd_ports lvds_fco_n_1] [get_bd_pins ad9670_axi4_1/lvds_fco_n]
connect_bd_net -net lvds_dco_n_1_1 [get_bd_ports lvds_dco_n_1] [get_bd_pins ad9670_axi4_1/lvds_dco_n]
connect_bd_net -net lvds_data_p_1_1 [get_bd_ports lvds_data_p_1] [get_bd_pins ad9670_axi4_1/lvds_data_p]
connect_bd_net -net lvds_fco_p_1_1 [get_bd_ports lvds_fco_p_1] [get_bd_pins ad9670_axi4_1/lvds_fco_p]
connect_bd_net -net lvds_dco_p_1_1 [get_bd_ports lvds_dco_p_1] [get_bd_pins ad9670_axi4_1/lvds_dco_p]
connect_bd_net -net lvds_data_n_1_1 [get_bd_ports lvds_data_n_1] [get_bd_pins ad9670_axi4_1/lvds_data_n]
connect_bd_net [get_bd_pins hv7321_axi4_1/pos] [get_bd_ports pos_1]
connect_bd_net [get_bd_pins hv7321_axi4_1/out_clk] [get_bd_ports out_clk_1]
connect_bd_net [get_bd_pins hv7321_axi4_1/sel] [get_bd_ports sel_1]
connect_bd_net [get_bd_pins hv7321_axi4_1/neg] [get_bd_ports neg_1]
connect_bd_net [get_bd_pins hv7321_axi4_2/pos] [get_bd_ports pos_2]
connect_bd_net [get_bd_pins hv7321_axi4_2/out_clk] [get_bd_ports out_clk_2]
connect_bd_net [get_bd_pins hv7321_axi4_2/sel] [get_bd_ports sel_2]
connect_bd_net [get_bd_pins hv7321_axi4_2/neg] [get_bd_ports neg_2]
connect_bd_net [get_bd_pins hv7321_axi4_3/pos] [get_bd_ports pos_3]
connect_bd_net [get_bd_pins hv7321_axi4_3/out_clk] [get_bd_ports out_clk_3]
connect_bd_net [get_bd_pins hv7321_axi4_3/sel] [get_bd_ports sel_3]
connect_bd_net [get_bd_pins hv7321_axi4_3/neg] [get_bd_ports neg_3]
connect_bd_net -net util_reduced_logic_0_Res [get_bd_pins REN_OR/Res] [get_bd_ports ren]
connect_bd_net -net util_reduced_logic_1_Res [get_bd_pins OEN_OR/Res] [get_bd_ports oen]
connect_bd_net [get_bd_pins hv7321_axi4_0/ren] [get_bd_pins REN_CONCAT/In0]
connect_bd_net [get_bd_pins hv7321_axi4_1/ren] [get_bd_pins REN_CONCAT/In1]
connect_bd_net [get_bd_pins hv7321_axi4_2/ren] [get_bd_pins REN_CONCAT/In2]
connect_bd_net [get_bd_pins hv7321_axi4_3/ren] [get_bd_pins REN_CONCAT/In3]
connect_bd_net [get_bd_pins REN_CONCAT/dout] [get_bd_pins REN_OR/Op1]
connect_bd_net [get_bd_pins OEN_CONCAT/dout] [get_bd_pins OEN_OR/Op1]
connect_bd_net [get_bd_pins hv7321_axi4_0/oen] [get_bd_pins OEN_CONCAT/In0]
connect_bd_net [get_bd_pins hv7321_axi4_1/oen] [get_bd_pins OEN_CONCAT/In1]
connect_bd_net [get_bd_pins hv7321_axi4_2/oen] [get_bd_pins OEN_CONCAT/In2]
connect_bd_net [get_bd_pins hv7321_axi4_3/oen] [get_bd_pins OEN_CONCAT/In3]
connect_bd_net [get_bd_pins hv7321_axi4_0/rx] [get_bd_pins RX01_CONCAT/In0] [get_bd_pins DAC_START_CONCAT/In1]
connect_bd_net [get_bd_pins zynq_ultra_ps_e_0/emio_spi0_ss_o_n] [get_bd_ports afe0_csn]
connect_bd_net [get_bd_pins zynq_ultra_ps_e_0/emio_spi0_ss1_o_n] [get_bd_ports afe1_csn]
connect_bd_net [get_bd_pins zynq_ultra_ps_e_0/emio_spi0_sclk_o] [get_bd_ports afe_sck]
connect_bd_net [get_bd_ports afe_sdio] [get_bd_pins AFE_SDIO_BUF/IOBUF_IO_IO]
connect_bd_net [get_bd_pins AFE_SDIO_BUF/IOBUF_IO_O] [get_bd_pins zynq_ultra_ps_e_0/emio_spi0_m_i] [get_bd_pins zynq_ultra_ps_e_0/emio_spi0_s_i]
connect_bd_net [get_bd_pins zynq_ultra_ps_e_0/emio_spi0_m_o] [get_bd_pins AFE_SDIO_BUF/IOBUF_IO_I]
connect_bd_net [get_bd_pins AFE_CLK_BUF/OBUF_DS_P] [get_bd_ports afe_clk_p]
connect_bd_net [get_bd_pins AFE_CLK_BUF/OBUF_DS_N] [get_bd_ports afe_clk_n]
connect_bd_net [get_bd_pins System_Clock_Sources/clk_out3] [get_bd_pins AFE_CLK_BUF/OBUF_IN]
connect_bd_net [get_bd_pins zynq_ultra_ps_e_0/emio_gpio_o] \
  [get_bd_pins xlslice_sdio_ctrl/Din] [get_bd_pins xlslice_pmod0/Din] [get_bd_pins xlslice_leds/Din] \
  [get_bd_pins xlslice_pmod1/Din] [get_bd_pins xlslice_pulser_start/Din] [get_bd_pins xlslice_dac_start/Din] \
  [get_bd_pins xlslice_adc_enable/Din]
connect_bd_net -net xlslice_0_Dout [get_bd_pins xlslice_sdio_ctrl/Dout] [get_bd_pins AFE_SDIO_BUF/IOBUF_IO_T]
connect_bd_net -net xlslice_debug_out_Dout [get_bd_pins xlslice_pmod0/Dout] [get_bd_ports pmod0]
connect_bd_net [get_bd_pins TRIG_BUF/OBUF_DS_P] [get_bd_ports tx_trig_out_p]
connect_bd_net [get_bd_pins TRIG_BUF/OBUF_DS_N] [get_bd_ports tx_trig_out_n]
connect_bd_net [get_bd_pins hv7321_axi4_0/tx] [get_bd_pins ad9670_axi4_0/tx_nrx] [get_bd_pins ad9670_axi4_1/tx_nrx] [get_bd_ports tx_0]
connect_bd_net [get_bd_pins TRIG_OR/Res] [get_bd_pins TRIG_BUF/OBUF_IN]
connect_bd_net [get_bd_pins xlconcat_1/dout] [get_bd_pins TRIG_OR/Op1]
connect_bd_net [get_bd_pins ad9670_axi4_1/tx_trig] [get_bd_pins xlconcat_1/In1]
connect_bd_net [get_bd_pins ad9670_axi4_0/tx_trig] [get_bd_pins xlconcat_1/In0]
connect_bd_net -net REN01_CONCAT_dout [get_bd_pins RX01_CONCAT/dout] [get_bd_pins RX01_OR/Op1]
connect_bd_net [get_bd_pins hv7321_axi4_1/rx] [get_bd_pins RX01_CONCAT/In1]
connect_bd_net -net REN01_CONCAT_dout1 [get_bd_pins RX23_CONCAT/dout] [get_bd_pins RX23_OR/Op1]
connect_bd_net [get_bd_pins hv7321_axi4_2/rx] [get_bd_pins RX23_CONCAT/In0]
connect_bd_net [get_bd_pins hv7321_axi4_3/rx] [get_bd_pins RX23_CONCAT/In1]
connect_bd_net [get_bd_pins RX23_OR/Res] [get_bd_ports rx_1]
connect_bd_net -net xlslice_pulser_start1_Dout [get_bd_pins xlslice_dac_start/Dout] [get_bd_pins DAC_START_CONCAT/In0]
connect_bd_net [get_bd_pins xlslice_adc_enable/Dout] \
  [get_bd_pins ad9670_axi4_1/enable] [get_bd_pins System_Clock_Sources/clk_out3_ce] [get_bd_pins ad9670_axi4_0/enable]
connect_bd_net [get_bd_pins RX01_OR/Res] [get_bd_ports rx_0]
connect_bd_net [get_bd_pins xlslice_pmod1/Dout] [get_bd_ports pmod1]
connect_bd_net [get_bd_pins xlslice_leds/Dout] [get_bd_ports leds]
connect_bd_net [get_bd_pins DAC_START_CONCAT/dout] [get_bd_pins DAC_START_OR/Op1]
connect_bd_net -net TRIG_OR1_Res [get_bd_pins DAC_START_OR/Res] [get_bd_pins ad5424_axi4_0/start]

# ---- address map ----
assign_bd_address -offset 0x30000000 -range 256M -target_address_space [get_bd_addr_spaces axi_dma_0/Data_S2MM] [get_bd_addr_segs zynq_ultra_ps_e_0/SAXIGP4/HP2_DDR_LOW]
exclude_bd_addr_seg -offset 0xC0000000 -range 512M -target_address_space [get_bd_addr_spaces axi_dma_0/Data_S2MM] [get_bd_addr_segs zynq_ultra_ps_e_0/SAXIGP4/HP2_QSPI]
exclude_bd_addr_seg -offset 0xFF000000 -range 16M -target_address_space [get_bd_addr_spaces axi_dma_0/Data_S2MM] [get_bd_addr_segs zynq_ultra_ps_e_0/SAXIGP4/HP2_LPS_OCM]
assign_bd_address -offset 0x00000000 -range 2G -target_address_space [get_bd_addr_spaces axi_dma_0/Data_SG] [get_bd_addr_segs zynq_ultra_ps_e_0/SAXIGP2/HP0_DDR_LOW]
assign_bd_address -offset 0xC0000000 -range 512M -target_address_space [get_bd_addr_spaces axi_dma_0/Data_SG] [get_bd_addr_segs zynq_ultra_ps_e_0/SAXIGP2/HP0_QSPI]
exclude_bd_addr_seg -offset 0xFF000000 -range 16M -target_address_space [get_bd_addr_spaces axi_dma_0/Data_SG] [get_bd_addr_segs zynq_ultra_ps_e_0/SAXIGP2/HP0_LPS_OCM]
assign_bd_address -offset 0x40000000 -range 256M -target_address_space [get_bd_addr_spaces axi_dma_1/Data_S2MM] [get_bd_addr_segs zynq_ultra_ps_e_0/SAXIGP5/HP3_DDR_LOW]
exclude_bd_addr_seg -offset 0xC0000000 -range 512M -target_address_space [get_bd_addr_spaces axi_dma_1/Data_S2MM] [get_bd_addr_segs zynq_ultra_ps_e_0/SAXIGP5/HP3_QSPI]
exclude_bd_addr_seg -offset 0xFF000000 -range 16M -target_address_space [get_bd_addr_spaces axi_dma_1/Data_S2MM] [get_bd_addr_segs zynq_ultra_ps_e_0/SAXIGP5/HP3_LPS_OCM]
assign_bd_address -offset 0x00000000 -range 2G -target_address_space [get_bd_addr_spaces axi_dma_1/Data_SG] [get_bd_addr_segs zynq_ultra_ps_e_0/SAXIGP3/HP1_DDR_LOW]
assign_bd_address -offset 0xC0000000 -range 512M -target_address_space [get_bd_addr_spaces axi_dma_1/Data_SG] [get_bd_addr_segs zynq_ultra_ps_e_0/SAXIGP3/HP1_QSPI]
exclude_bd_addr_seg -offset 0xFF000000 -range 16M -target_address_space [get_bd_addr_spaces axi_dma_1/Data_SG] [get_bd_addr_segs zynq_ultra_ps_e_0/SAXIGP3/HP1_LPS_OCM]
assign_bd_address -offset 0x00A0000000 -range 4K -target_address_space [get_bd_addr_spaces zynq_ultra_ps_e_0/Data] [get_bd_addr_segs hv7321_axi4_0/S_AXI/S_AXI_reg]
assign_bd_address -offset 0x00A0001000 -range 4K -target_address_space [get_bd_addr_spaces zynq_ultra_ps_e_0/Data] [get_bd_addr_segs ad5424_axi4_0/S_AXI/S_AXI_reg]
assign_bd_address -offset 0x00A0002000 -range 4K -target_address_space [get_bd_addr_spaces zynq_ultra_ps_e_0/Data] [get_bd_addr_segs ad9670_axi4_0/S_AXI/S_AXI_reg]
assign_bd_address -offset 0x00A0003000 -range 4K -target_address_space [get_bd_addr_spaces zynq_ultra_ps_e_0/Data] [get_bd_addr_segs axi_dma_0/S_AXI_LITE/Reg]
assign_bd_address -offset 0x00A0004000 -range 4K -target_address_space [get_bd_addr_spaces zynq_ultra_ps_e_0/Data] [get_bd_addr_segs ad9670_axi4_1/S_AXI/S_AXI_reg]
assign_bd_address -offset 0x00A0005000 -range 4K -target_address_space [get_bd_addr_spaces zynq_ultra_ps_e_0/Data] [get_bd_addr_segs axi_dma_1/S_AXI_LITE/Reg]
assign_bd_address -offset 0x00A0006000 -range 4K -target_address_space [get_bd_addr_spaces zynq_ultra_ps_e_0/Data] [get_bd_addr_segs hv7321_axi4_1/S_AXI/S_AXI_reg]
assign_bd_address -offset 0x00A0007000 -range 4K -target_address_space [get_bd_addr_spaces zynq_ultra_ps_e_0/Data] [get_bd_addr_segs hv7321_axi4_2/S_AXI/S_AXI_reg]
assign_bd_address -offset 0x00A0008000 -range 4K -target_address_space [get_bd_addr_spaces zynq_ultra_ps_e_0/Data] [get_bd_addr_segs hv7321_axi4_3/S_AXI/S_AXI_reg]

validate_bd_design
save_bd_design
